# Altium schematic sheet KNX-RELAY-8CH_V2.SchDoc
size 297 x 209 mm
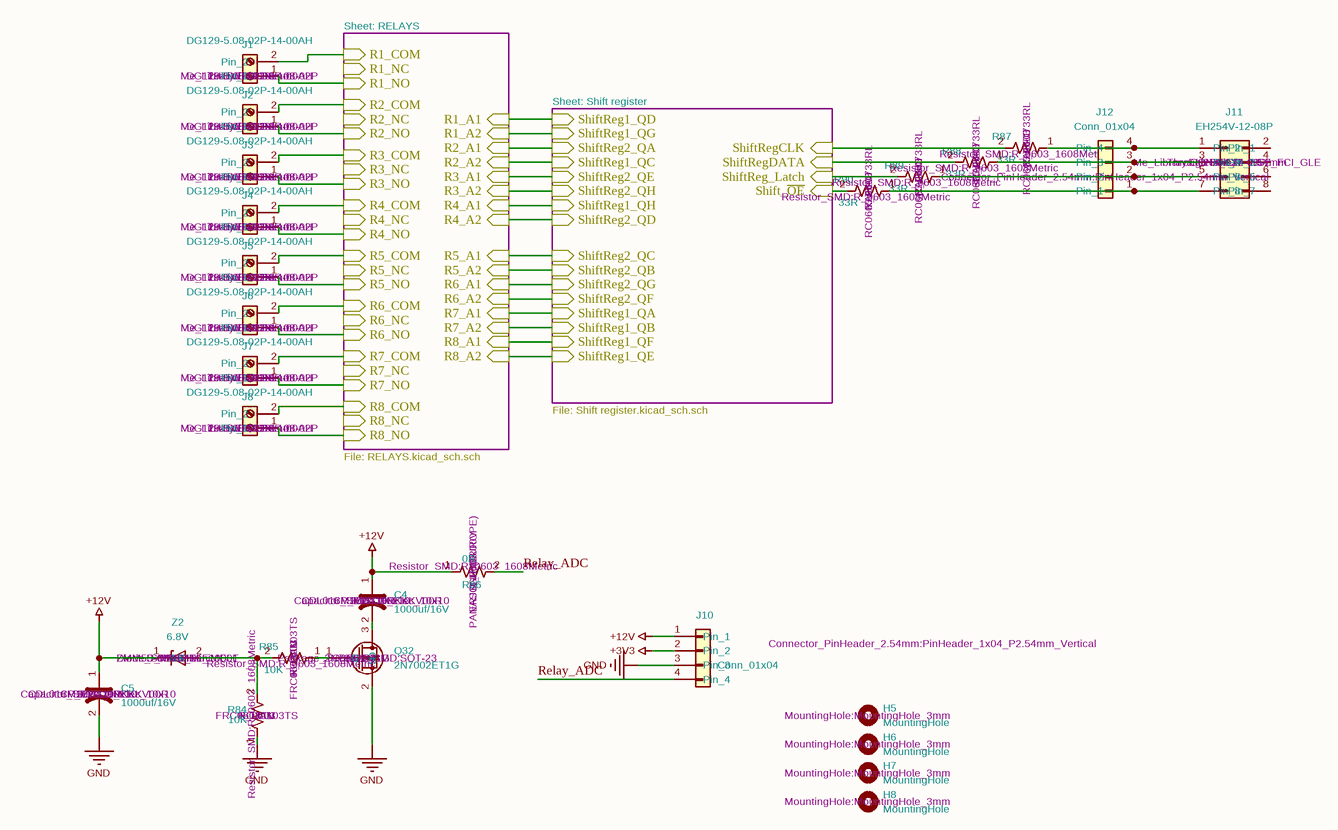
[diagram p0: KNX-RELAY-8CH_V2.SchDoc]

## Parts
C4  Manufacturer Part Number: CDL016M102G10PKKKV00R  Manufacturer: SUSCON  Footprint: Capacitor_SMD:CP_Elec_10x10  [CP_Elec_10x10]  (hidden comment: 1000uf/16V)
C5  Manufacturer Part Number: CDL016M102G10PKKKV00R  Manufacturer: SUSCON  Footprint: Capacitor_SMD:CP_Elec_10x10  [CP_Elec_10x10]  (hidden comment: 1000uf/16V)
H5  Footprint: MountingHole:MountingHole_3mm  [MountingHole_3mm]  (hidden comment: MountingHole)  (no BOM)
H6  Footprint: MountingHole:MountingHole_3mm  [MountingHole_3mm]  (hidden comment: MountingHole)  (no BOM)
H7  Footprint: MountingHole:MountingHole_3mm  [MountingHole_3mm]  (hidden comment: MountingHole)  (no BOM)
H8  Footprint: MountingHole:MountingHole_3mm  [MountingHole_3mm]  (hidden comment: MountingHole)  (no BOM)
J1  Manufacturer: DEGSON  Package: THT V/T  5.08mm  Footprint: Me_Library:DG129-5.08-02P  [DG129-5.08-02P]  (hidden comment: DG129-5.08-02P-14-00AH)
J2  Manufacturer: DEGSON  Package: THT V/T  5.08mm  Footprint: Me_Library:DG129-5.08-02P  [DG129-5.08-02P]  (hidden comment: DG129-5.08-02P-14-00AH)
J3  Manufacturer: DEGSON  Package: THT V/T  5.08mm  Footprint: Me_Library:DG129-5.08-02P  [DG129-5.08-02P]  (hidden comment: DG129-5.08-02P-14-00AH)
J4  Manufacturer: DEGSON  Package: THT V/T  5.08mm  Footprint: Me_Library:DG129-5.08-02P  [DG129-5.08-02P]  (hidden comment: DG129-5.08-02P-14-00AH)
J5  Manufacturer: DEGSON  Package: THT V/T  5.08mm  Footprint: Me_Library:DG129-5.08-02P  [DG129-5.08-02P]  (hidden comment: DG129-5.08-02P-14-00AH)
J6  Manufacturer: DEGSON  Package: THT V/T  5.08mm  Footprint: Me_Library:DG129-5.08-02P  [DG129-5.08-02P]  (hidden comment: DG129-5.08-02P-14-00AH)
J7  Manufacturer: DEGSON  Package: THT V/T  5.08mm  Footprint: Me_Library:DG129-5.08-02P  [DG129-5.08-02P]  (hidden comment: DG129-5.08-02P-14-00AH)
J8  Manufacturer: DEGSON  Package: THT V/T  5.08mm  Footprint: Me_Library:DG129-5.08-02P  [DG129-5.08-02P]  (hidden comment: DG129-5.08-02P-14-00AH)
J10  value Conn_01x04  Footprint: Connector_PinHeader_2.54mm:PinHeader_1x04_P2.54mm_Vertical  [PinHeader_1x04_P2.54mm_Vertical]  (hidden comment: 5PS1SDA85-104G0NNNAL-00)
J11  Manufacturer: XFCN  Package: Through Hole,P=2.54mm  Footprint: Me_Library:CON8_2X4_USZ_FCI_GLE  [CON8_2X4_USZ_FCI_GLE]  (hidden comment: EH254V-12-08P)
J12  value Conn_01x04  Footprint: Connector_PinHeader_2.54mm:PinHeader_1x04_P2.54mm_Vertical  [PinHeader_1x04_P2.54mm_Vertical]  (hidden comment: 5PS1SDA85-104G0NNNAL-00)
Q32  Manufacturer: onsemi  Footprint: Package_TO_SOT_SMD:SOT-23  [SOT-23]  (hidden comment: 2N7002ET1G)
R84  Manufacturer Part Number: FRC0603J103TS  Manufacturer: FOJAN  Package: R_0603  Footprint: Resistor_SMD:R_0603_1608Metric  [R_0603_1608Metric]  (hidden comment: 10K)
R85  Manufacturer Part Number: FRC0603J103TS  Manufacturer: FOJAN  Package: R_0603  Footprint: Resistor_SMD:R_0603_1608Metric  [R_0603_1608Metric]  (hidden comment: 10K)
R86  value 0R  Manufacturer: PANASONIC(EUROPE)  Package: R_0603  Footprint: Resistor_SMD:R_0603_1608Metric  [R_0603_1608Metric]  (hidden comment: ERJ3GEY0R00V)
R87  Manufacturer Part Number: RC0603JR-0733RL  Manufacturer: YAGEO  Package: R_0603  Footprint: Resistor_SMD:R_0603_1608Metric  [R_0603_1608Metric]  (hidden comment: 33R)
R88  Manufacturer Part Number: RC0603JR-0733RL  Manufacturer: YAGEO  Package: R_0603  Footprint: Resistor_SMD:R_0603_1608Metric  [R_0603_1608Metric]  (hidden comment: 33R)
R89  Manufacturer Part Number: RC0603JR-0733RL  Manufacturer: YAGEO  Package: R_0603  Footprint: Resistor_SMD:R_0603_1608Metric  [R_0603_1608Metric]  (hidden comment: 33R)
R90  Manufacturer Part Number: RC0603JR-0733RL  Manufacturer: YAGEO  Package: R_0603  Footprint: Resistor_SMD:R_0603_1608Metric  [R_0603_1608Metric]  (hidden comment: 33R)
Z2  Manufacturer Part Number: ZMM55-C6V8_R1_10001  Manufacturer: PANJIT  Footprint: Diode_SMD:D_MiniMELF  [D_MiniMELF]  (hidden comment: 6.8V)

## Sub-sheets
RELAYS = RELAYS.SchDoc: R1_A1 (in), R1_A2 (in), R1_COM (in), R1_NC (in), R1_NO (in), R2_A1 (in), R2_A2 (in), R2_COM (in), R2_NC (in), R2_NO (in), R3_A1 (in), R3_A2 (in), R3_COM (in), R3_NC (in), R3_NO (in), R4_A1 (in), R4_A2 (in), R4_COM (in), R4_NC (in), R4_NO (in), R5_A1 (in), R5_A2 (in), R5_COM (in), R5_NC (in), R5_NO (in), R6_A1 (in), R6_A2 (in), R6_COM (in), R6_NC (in), R6_NO (in), R7_A1 (in), R7_A2 (in), R7_COM (in), R7_NC (in), R7_NO (in), R8_A1 (in), R8_A2 (in), R8_COM (in), R8_NC (in), R8_NO (in)
Shift register = Shift register.SchDoc: ShiftReg1_QA (in), ShiftReg1_QB (in), ShiftReg1_QC (in), ShiftReg1_QD (in), ShiftReg1_QE (in), ShiftReg1_QF (in), ShiftReg1_QG (in), ShiftReg1_QH (in), ShiftReg2_QA (in), ShiftReg2_QB (in), ShiftReg2_QC (in), ShiftReg2_QD (in), ShiftReg2_QE (in), ShiftReg2_QF (in), ShiftReg2_QG (in), ShiftReg2_QH (in), ShiftRegCLK (in), ShiftRegDATA (in), ShiftReg_Latch (in), Shift_~{OE} (in)

## Nets
+3V3: J10.2(Pin_2)
+12V: C4.1 C5.1 J10.1(Pin_1) R86.1 Z2.1(K)
GND: C5.2 J10.3(Pin_3) Q32.2(S) R84.1
Relay_ADC: J10.4(Pin_4) R86.2
NetC4_2: C4.2 Q32.3(D)
NetJ1_1: J1.1(Pin_1) ; sheet RELAYS/R1_NO
NetJ1_2: J1.2(Pin_2) ; sheet RELAYS/R1_COM
NetJ2_1: J2.1(Pin_1) ; sheet RELAYS/R2_NO
NetJ2_2: J2.2(Pin_2) ; sheet RELAYS/R2_COM
NetJ3_1: J3.1(Pin_1) ; sheet RELAYS/R3_NO
NetJ3_2: J3.2(Pin_2) ; sheet RELAYS/R3_COM
NetJ4_1: J4.1(Pin_1) ; sheet RELAYS/R4_NO
NetJ4_2: J4.2(Pin_2) ; sheet RELAYS/R4_COM
NetJ5_1: J5.1(Pin_1) ; sheet RELAYS/R5_NO
NetJ5_2: J5.2(Pin_2) ; sheet RELAYS/R5_COM
NetJ6_1: J6.1(Pin_1) ; sheet RELAYS/R6_NO
NetJ6_2: J6.2(Pin_2) ; sheet RELAYS/R6_COM
NetJ7_1: J7.1(Pin_1) ; sheet RELAYS/R7_NO
NetJ7_2: J7.2(Pin_2) ; sheet RELAYS/R7_COM
NetJ8_1: J8.1(Pin_1) ; sheet RELAYS/R8_NO
NetJ8_2: J8.2(Pin_2) ; sheet RELAYS/R8_COM
NetJ11_1: J11.1(Pin_1) J12.4(Pin_4) R87.1
NetJ11_3: J11.3(Pin_3) J12.3(Pin_3) R88.1
NetJ11_5: J11.5(Pin_5) J12.2(Pin_2) R89.1
NetJ11_7: J11.7(Pin_7) J12.1(Pin_1) R90.1
NetQ32_1: Q32.1(G) R85.1
NetR84_2: R84.2 R85.2 Z2.2(A)
NetR87_2: R87.2 ; sheet Shift register/ShiftRegCLK
NetR88_2: R88.2 ; sheet Shift register/ShiftRegDATA
NetR89_2: R89.2 ; sheet Shift register/ShiftReg_Latch
NetR90_2: R90.2 ; sheet Shift register/Shift_~{OE}
(unnamed): sheet RELAYS/R1_A1, sheet Shift register/ShiftReg1_QD
(unnamed): sheet RELAYS/R1_A2, sheet Shift register/ShiftReg1_QG
(unnamed): sheet RELAYS/R2_A1, sheet Shift register/ShiftReg2_QA
(unnamed): sheet RELAYS/R2_A2, sheet Shift register/ShiftReg1_QC
(unnamed): sheet RELAYS/R3_A1, sheet Shift register/ShiftReg2_QE
(unnamed): sheet RELAYS/R3_A2, sheet Shift register/ShiftReg2_QH
(unnamed): sheet RELAYS/R4_A1, sheet Shift register/ShiftReg1_QH
(unnamed): sheet RELAYS/R4_A2, sheet Shift register/ShiftReg2_QD
(unnamed): sheet RELAYS/R5_A1, sheet Shift register/ShiftReg2_QC
(unnamed): sheet RELAYS/R5_A2, sheet Shift register/ShiftReg2_QB
(unnamed): sheet RELAYS/R6_A1, sheet Shift register/ShiftReg2_QG
(unnamed): sheet RELAYS/R6_A2, sheet Shift register/ShiftReg2_QF
(unnamed): sheet RELAYS/R7_A1, sheet Shift register/ShiftReg1_QA
(unnamed): sheet RELAYS/R7_A2, sheet Shift register/ShiftReg1_QB
(unnamed): sheet RELAYS/R8_A1, sheet Shift register/ShiftReg1_QF
(unnamed): sheet RELAYS/R8_A2, sheet Shift register/ShiftReg1_QE

Not connected (* = marked no-connect by the designer): J11 2(Pin_2) 4(Pin_4) 6(Pin_6) 8(Pin_8)

## Notes on the sheet
- Sheet: RELAYS
- Sheet: Shift register
- File: RELAYS.kicad_sch.sch
- File: Shift register.kicad_sch.sch
- 1
- 2
- 3
- 4
- 5
- 6
- A
- B
- C
- D
- Title:
- File: KNX-RELAY-8CH_V2.kicad_sch
- Sheet: /
- KiCad E.D.A.  kicad (5.1.4)-1
- Size: A4
- Date:
- Rev:
- Id: 1/1

## Library data of the parts
C4 C5 = C_US: Package: CP_Elec_10x10; Value: 1000uf/16V
J1-J8 = Screw_Terminal_01x02: Manufacturer Part Number: DG129-5.08-02P-14-00AH; Value: DG129-5.08-02P-14-00AH
J10 J12 = Conn_01x04: FEMALE HEADER 4PIN(1x4) 2.54mm THT V/T TRAY; Manufacturer: AMTEK; Manufacturer Part Number: 5PS1SDA85-104G0NNNAL-00
J11 = Conn_02x04_Odd_Even: Manufacturer Part Number: EH254V-12-08P; Value: EH254V-12-08P
Q32 = Q_NMOS_Depletion_GSD: Manufacturer Part Number: 2N7002ET1G; Package: SOT-23; Value: 2N7002ET1G
R84 R85 R87-R90 = R_US
  R84 R85: Value: 10K
  R87-R90: Value: 33R
R86 = R_US: RES.(1608) 0603 0 Ohms 1/10W JUMPER; Manufacturer Part Number: ERJ3GEY0R00V
Z2 = D_Zener: Package: D_MiniMELF; Value: 6.8V
H5-H8 = MountingHole: Value: MountingHole